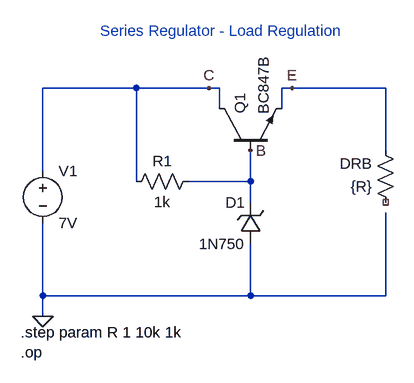
[diagram p0: schematic Series Voltage Regulator.asc]
Series Voltage Regulator.asc, the LTspice schematic file:
Version 4
SHEET 1 880 680
WIRE 16 96 -128 96
WIRE 128 96 16 96
WIRE 144 96 128 96
WIRE 256 96 240 96
WIRE 400 96 256 96
WIRE 144 128 144 96
WIRE 240 128 240 96
WIRE 400 192 400 96
WIRE -128 224 -128 96
WIRE 16 240 16 96
WIRE 192 240 192 192
WIRE 192 240 96 240
WIRE 192 272 192 240
WIRE -128 416 -128 304
WIRE 192 416 192 336
WIRE 192 416 -128 416
WIRE 400 416 400 288
WIRE 400 416 192 416
WIRE -128 448 -128 416
FLAG -128 448 0
FLAG 192 192 B
FLAG 256 96 E
FLAG 128 96 C
SYMBOL npn 144 192 R270
SYMATTR InstName Q1
SYMATTR Value BC847B
SYMBOL res 112 224 R90
WINDOW 0 0 56 VBottom 2
WINDOW 3 32 56 VTop 2
SYMATTR InstName R1
SYMATTR Value 1k
SYMBOL res 416 288 R180
WINDOW 0 36 76 Left 2
WINDOW 3 36 40 Left 2
SYMATTR InstName DRB
SYMATTR Value {R}
SYMBOL zener 208 336 R180
WINDOW 0 24 64 Left 2
WINDOW 3 24 0 Left 2
SYMATTR InstName D1
SYMATTR Value 1N750
SYMBOL voltage -128 208 R0
WINDOW 123 0 0 Left 0
WINDOW 39 0 0 Left 0
SYMATTR InstName V1
SYMATTR Value 7V
TEXT -162 472 Left 2 !.step param R 1 10k 1k \n.op
TEXT -40 8 Left 2 ;Series Regulator - Load Regulation

The netlist it stands for:
* Series Voltage Regulator.asc
Q1 C B E 0 BC847B
R1 B C 1k
R§DRB NC_01 E {R}
D1 0 B 1N750
V1 C 0 7V
.model D D
.lib standard.dio
.model NPN NPN
.model PNP PNP
.lib standard.bjt
.step param R 1 10k 1k
.op
* Series Regulator - Load Regulation
.backanno
.end

* Results of the author's LTspice run, read from the files saved beside the schematic
* From the log:
*   Semiconductor Device Operating Points:
*                           --- Diodes ---
*   Name:      d1
*   Model:    1n750
*   Id:     -2.43e-03
*   Vd:     -4.57e+00
*   Req:     3.69e+01
*   CAP:     5.96e-11
*                           --- Bipolar Transistors ---
*   Name:       q1
*   Model:    bc847b
*   Ib:      -1.24e-11
*   Ic:       1.24e-11
*   Vbe:     -1.12e-02
*   Vbc:     -2.43e+00
*   Vce:      2.42e+00
*   BetaDC:  -1.00e+00
*   Gm:       4.71e-13
*   Rpi:      9.93e+11
*   Rx:       1.00e+01
*   Ro:       6.97e+15
*   Cbe:      1.24e-11
*   Cbc:      1.07e-12
*   Cjs:      0.00e+00
*   BetaAC:   4.68e-01
*   Cbx:      6.57e-13
*   Ft:       1.00e-02